# EAGLE board lighthouse-booster (EAGLE 8.3.2)
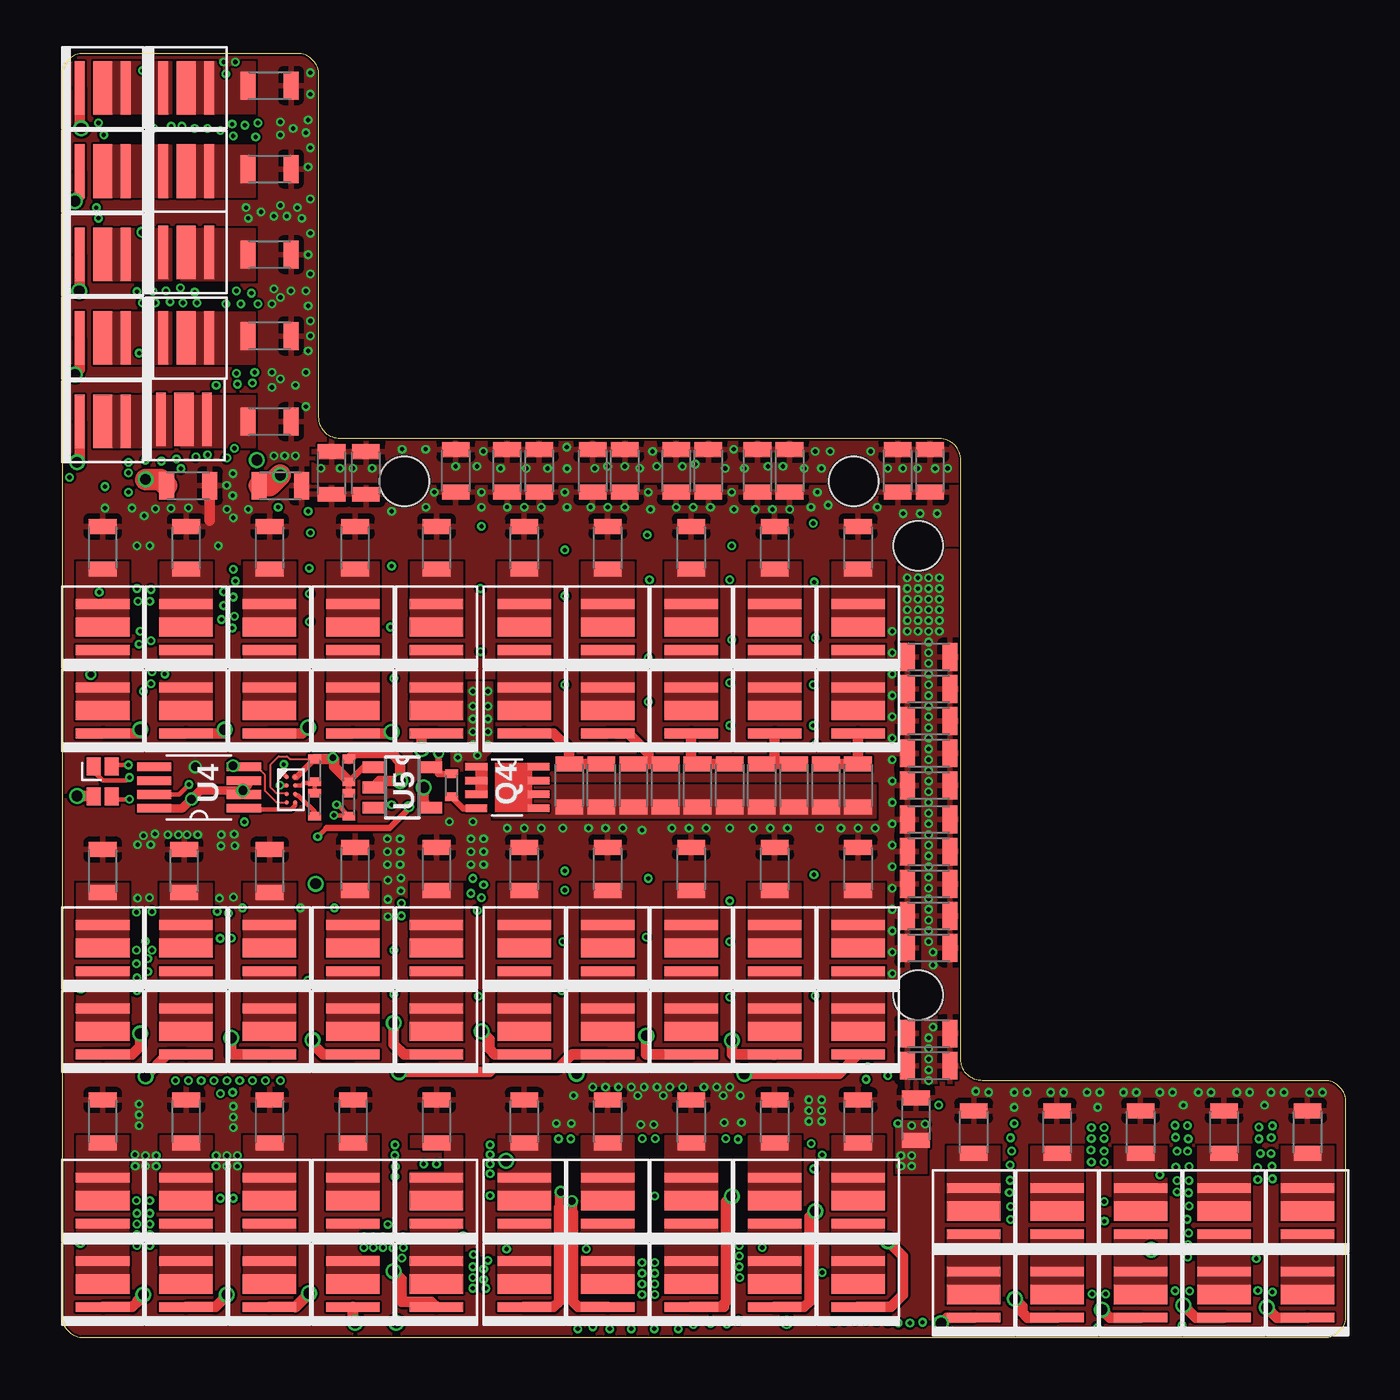
[diagram p2: board, top side]
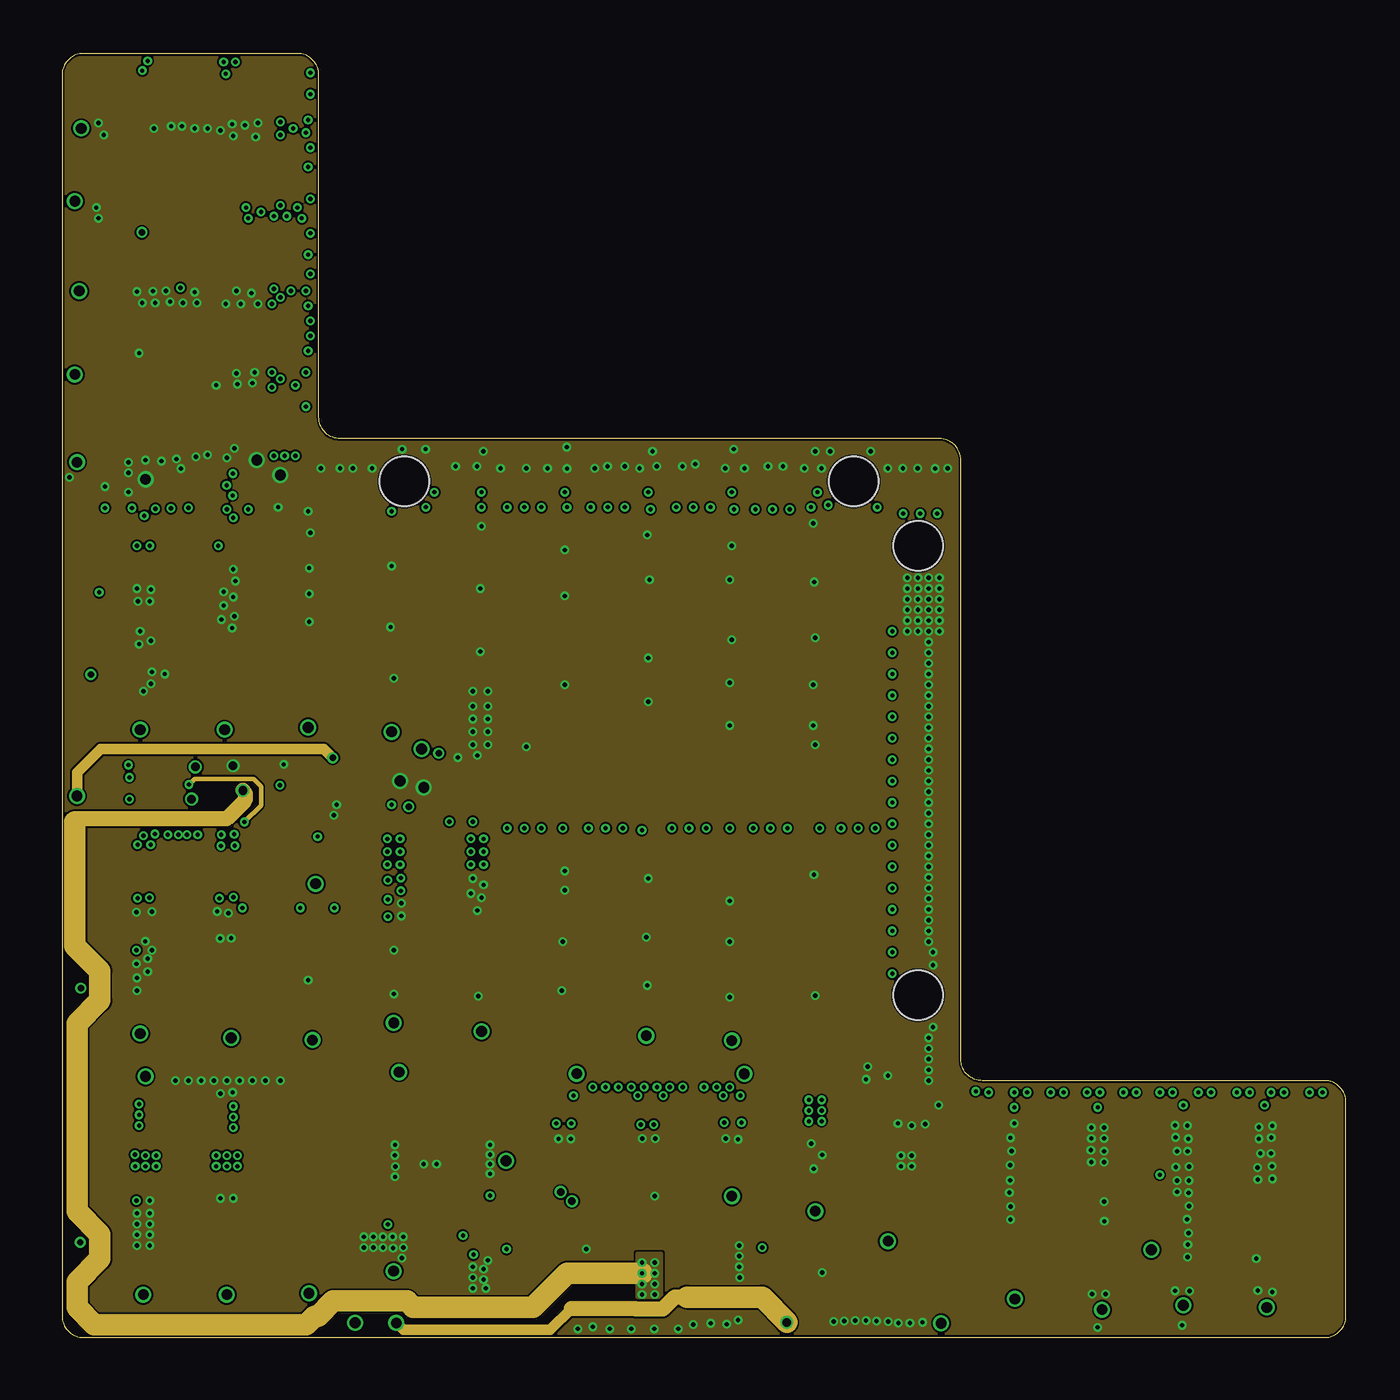
[diagram p3: board, inner layer Route2]
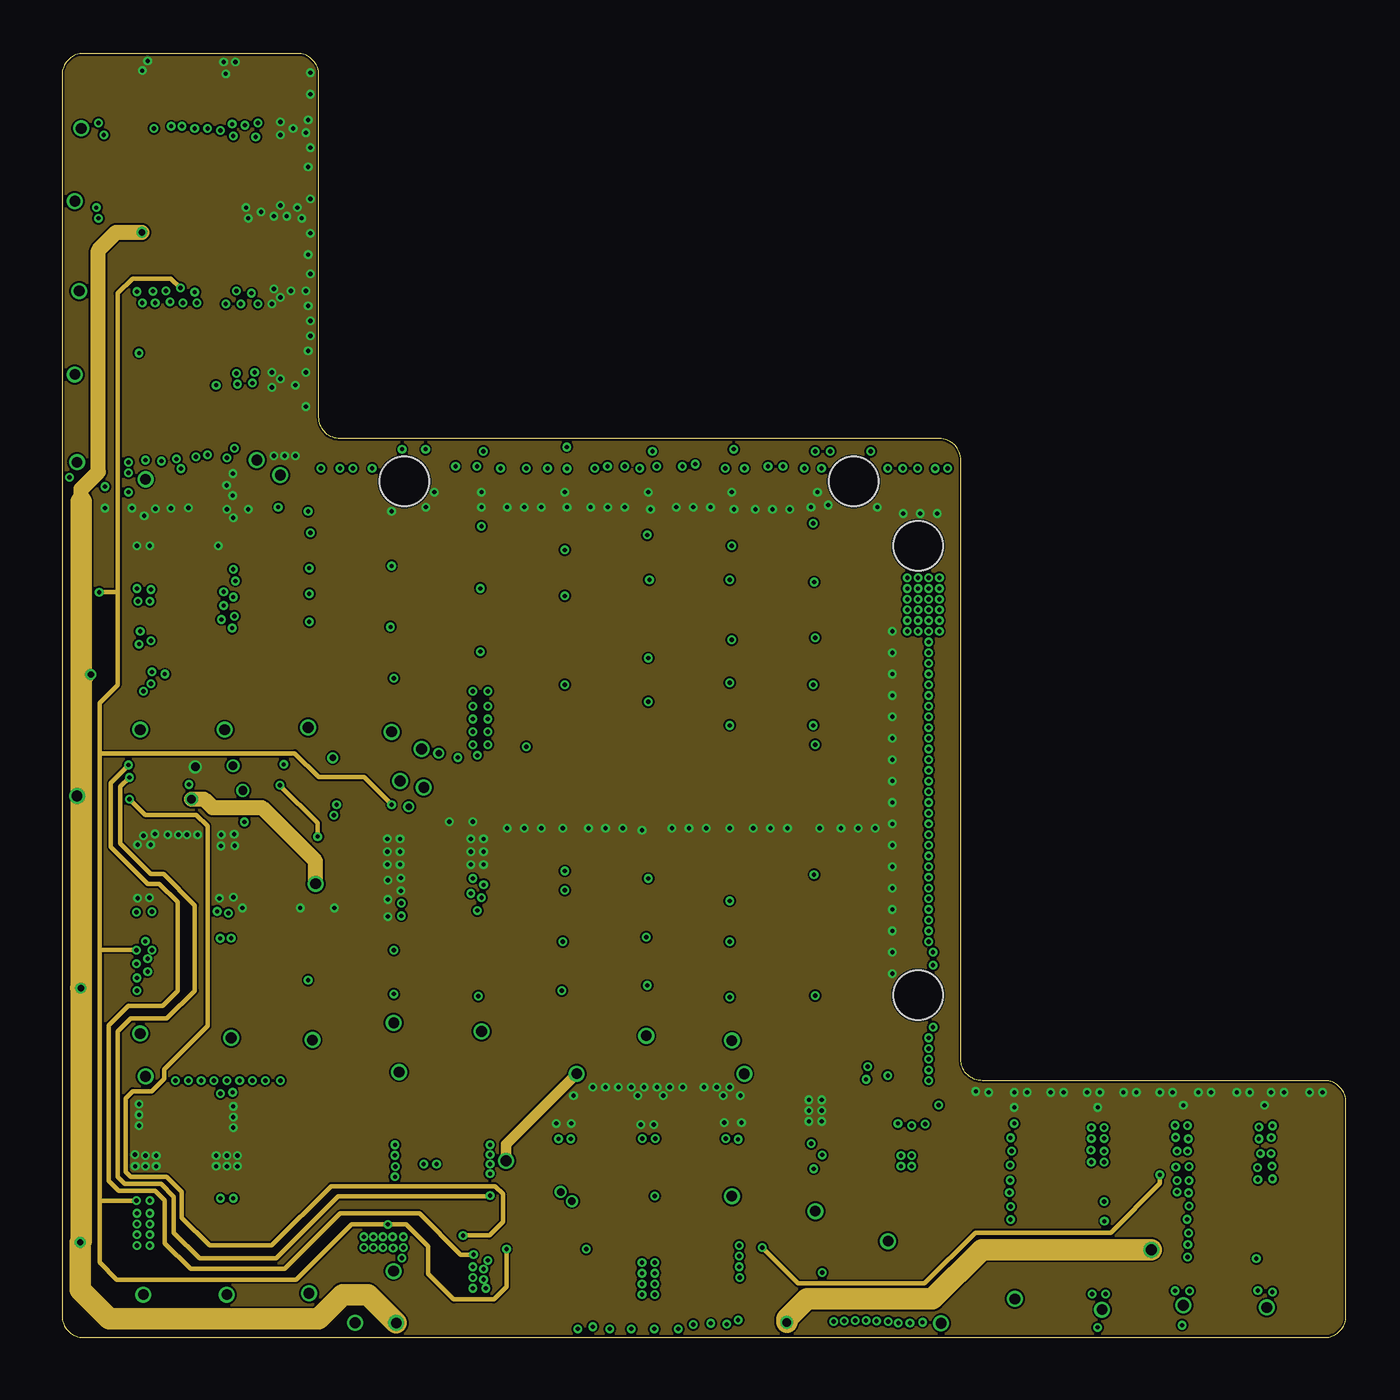
[diagram p4: board, inner layer Route15]
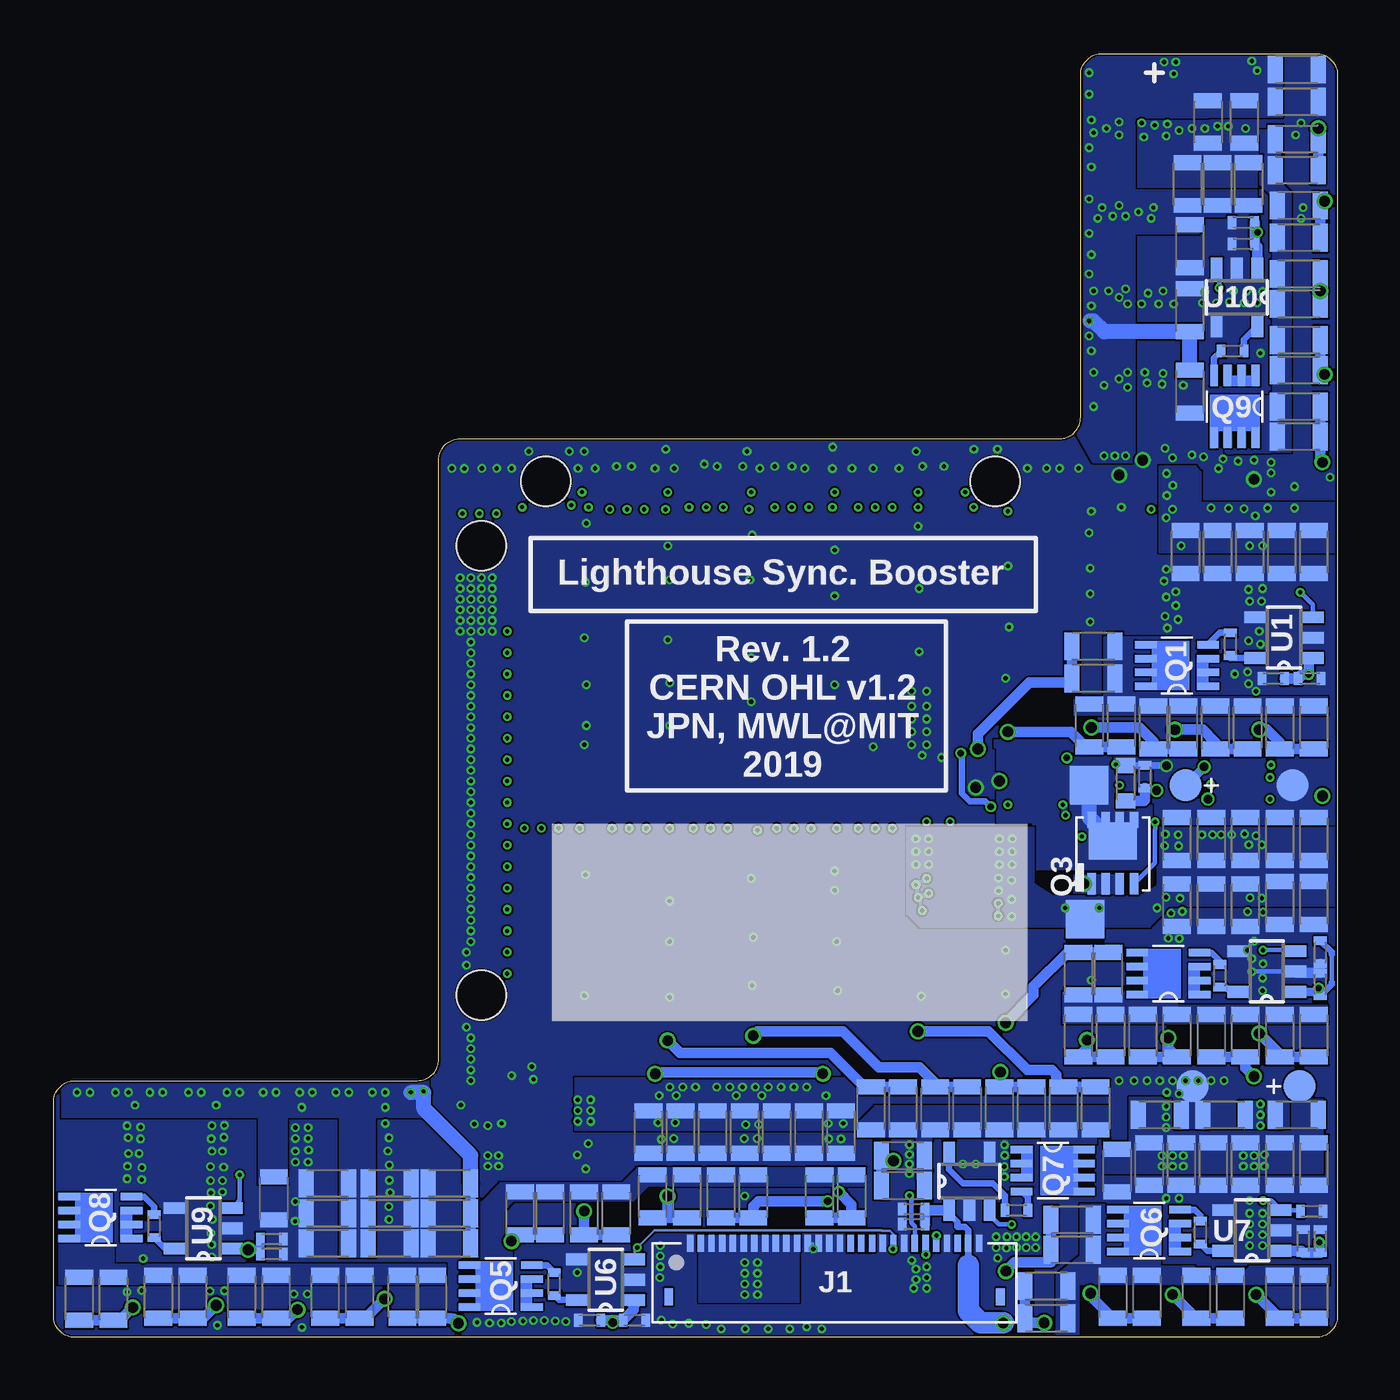
[diagram p5: board, bottom side, seen from below]

Size 60 x 60 mm. Coordinates in mm from the lower left corner, seen from the top.
Outline: 42,13 42,41 arc90 41,42 13,42 arc-90 12,43 12,59 arc90 11,60 1,60 arc90 0,59 0,1 arc90 1,0 59,0 arc90 60,1 60,11 arc90 59,12 43,12 arc-90 42,13
Copper layers (1+2*15+16): Top 0.035mm / dielectric 0.2mm / Route2 0.0175mm / dielectric 1.065mm / Route15 0.0175mm / dielectric 0.2mm / Bottom 0.035mm
Design rules "jlcpcb-4-layer_JLC7628-stackup *": minimum track width 3.5mil, minimum drill 0.2mm, track to track 3.5mil, track to pad 5mil, pad to pad 5mil, via to via 5mil, smd to smd 0mil, copper to edge 0.1mm, drill to drill 5mil, minimum pad ring 4mil, minimum via ring 4mil, stop-mask expansion 3mil, vias tented up to drill 100mil, thermal gap 10mil
Holes 2.3 mm at 40,37 37,40 16,40 40,16
bKeepout: area 7.7,7.8 to 60.1,60

## Footprints (pad centres in the part's own frame; a part is rotated, then mirrored left to right if it is on the bottom)
0805T = smd 0.7 x 1.3: 1 -1,0; 2 1,0
0402T = smd 0.4 x 0.6: 1 -0.533,0; 2 0.533,0
0603T = smd 0.7 x 0.9: 1 -0.82,0; 2 0.82,0
C5MMA-SMD = smd 1.5 x 1.5: A 2.5,0; C -2.5,0
LUXEON-3.7MM = smd 0.9 x 2.5: A1 0,0 | smd 0.45 x 2.5: A2 1.075,0; C -1.075,0
LTST-C19HE1WT = smd 0.65 x 0.85: 1 -0.427,0.725; 2 0.425,0.725; 3 0.425,-0.675; 4 -0.427,-0.675
Y5B/Y5BW-28 = smd 0.3 x 0.8: 1 -6.75,0; 2 -6.25,0; 3 -5.75,0; 4 -5.25,0; 5 -4.75,0; 6 -4.25,0; 7 -3.75,0; 8 -3.25,0; 9 -2.75,0; 10 -2.25,0; 11 -1.75,0; 12 -1.25,0; 13 -0.75,0; 14 -0.25,0; 15 0.25,0; 16 0.75,0; 17 1.25,0; 18 1.75,0; 19 2.25,0; 20 2.75,0; 21 3.25,0; 22 3.75,0; 23 4.25,0; 24 4.75,0; 25 5.25,0; 26 5.75,0; 27 6.25,0; 28 6.75,0 | smd 0.4 x 0.8: P$1 7.75,-2.5; P$2 -7.75,-2.5
PG-TSDSON-8 = smd 1 x 0.35: 1 -1.45,0.975; 2 -1.45,0.325; 3 -1.45,-0.325; 4 -1.45,-0.975; 5 1.45,-0.975; 6 1.45,-0.325; 7 1.45,0.325; 8 1.45,0.975
POWERPACK-1212-8 = smd 1 x 0.4: 1 -0.5,0.99; 2 -0.5,0.33; 3 -0.5,-0.33; 4 -0.5,-0.99 | smd 0.76 x 0.4: 5 2.48,-0.99; 6 2.48,-0.33; 7 2.48,0.33; 8 2.48,0.99 | smd 1.725 x 2.235: PAD 1.5,0
TP18SQ = smd 1.8 x 1.8: TP 0,0
SOT-23-5 = smd 0.55 x 1: 1 -0.95,-1.35; 2 0,-1.35; 3 0.95,-1.35; 4 0.95,1.35; 5 -0.95,1.35
DSBGA8-1.9X0.9MM = smd 0.22 x 0.22: A1 -0.6,-0.2; A2 -0.6,0.2; B1 -0.2,-0.2; B2 -0.2,0.2; C1 0.2,-0.2; C2 0.2,0.2; D1 0.6,-0.2; D2 0.6,0.2
MSOP-8-3X3 = smd 1.6 x 0.4: 1 -2.1,0.975; 2 -2.1,0.325; 3 -2.1,-0.325; 4 -2.1,-0.975; 5 2.1,-0.325; 6 2.1,-0.975; 7 2.1,0.325; 8 2.1,0.975

## Placement (x,y rotation side)
C1  22uF  [0805T]  18.4,40.5 270 top
C2  22uF  [0805T]  2.7,23.3 270 bottom
C3  0.1uF  [0402T]  1.3,30.8 0 bottom
C4  0.1uF  [0402T]  0.8,16.5 90 bottom
C5  4.7uF  [0603T]  9.9,25.9 90 bottom
C6  22uF  [0805T]  5.6,36.7 90 bottom
C7  22uF  [0805T]  5.9,20.2 90 bottom
C8  10nF  [0402T]  3,30.8 180 bottom
C9  10nF  [0402T]  0.8,18 270 bottom
C10  0.1uF  [0402T]  9,26.2 90 bottom
C11  22uF  [0805T]  4.1,36.7 90 bottom
C12  22uF  [0805T]  4.3,20.2 90 bottom
C13  22uF  [0805T]  2.6,36.7 90 bottom
C14  22uF  [0805T]  2.7,20.3 90 bottom
C15  100pF  [0402T]  11.8,24.9 270 top
C16  22uF  [0805T]  1.1,36.7 90 bottom
C17  22uF  [0805T]  1.1,20.3 90 bottom
C18  22uF  [0805T]  12.6,40.4 90 top
C19  22uF  [0805T]  7.5,20.2 270 bottom
C20  22uF  [0805T]  14.2,40.4 90 top
C21  22uF  [0805T]  7.5,23.3 90 bottom
C22  22uF  [0805T]  10.2,39.8 180 top
C23  22uF  [0805T]  5.9,23.3 90 bottom
C24  22uF  [0805T]  5.9,39.8 180 top
C25  22uF  [0805T]  4.3,23.3 90 bottom
C26  22uF  [0805T]  7.1,36.7 270 bottom
C27  22uF  [0805T]  1.1,23.3 90 bottom
C28  2.2mF  [C5MMA-SMD]  4.28,11.74 0 bottom
C29  2.2mF  [C5MMA-SMD]  4.6,25.8 180 bottom
C30  22uF  [0805T]  39.05,40.5 270 top
C31  22uF  [0805T]  40.5,12.7 180 top
C32  22uF  [0805T]  5.3,10.4 0 bottom
C33  0.1uF  [0402T]  13.4,26.5 90 top
C34  0.1uF  [0402T]  32.85,0.8 0 bottom
C35  0.1uF  [0402T]  0.8,4.5 90 bottom
C36  22uF  [0805T]  26.3,40.5 270 top
C37  22uF  [0805T]  26.2,9.6 90 bottom
C38  22uF  [0805T]  5.8,8.1 90 bottom
C39  10nF  [0402T]  13.4,24.9 270 top
C40  10nF  [0402T]  34.95,0.8 180 bottom
C41  10nF  [0402T]  1.6,4.5 90 bottom
C42  22uF  [0805T]  24.8,40.5 270 top
C43  22uF  [0805T]  24.7,9.6 90 bottom
C44  22uF  [0805T]  4.3,8.1 90 bottom
C45  22uF  [0805T]  22.3,40.5 270 top
C46  22uF  [0805T]  23.2,9.6 90 bottom
C47  22uF  [0805T]  2.7,8.1 90 bottom
C48  22uF  [0805T]  20.8,40.5 270 top
C49  22uF  [0805T]  39.9,10.2 90 top
C50  22uF  [0805T]  1.1,8.1 90 bottom
C51  22uF  [0805T]  28.7,40.5 90 top
C52  22uF  [0805T]  27.7,9.6 270 bottom
C53  22uF  [0805T]  7.3,8.1 270 bottom
C54  22uF  [0805T]  30.2,40.5 90 top
C55  22uF  [0805T]  29.2,9.6 270 bottom
C56  22uF  [0805T]  8.8,8.1 270 bottom
C57  22uF  [0805T]  32.5,40.5 90 top
C58  22uF  [0805T]  30.7,9.6 270 bottom
C59  22uF  [0805T]  8.3,10.4 0 bottom
C60  22uF  [0805T]  34,40.5 90 top
C61  22uF  [0805T]  32.2,9.6 270 bottom
C62  22uF  [0805T]  10.3,7.8 270 bottom
C63  22uF  [0805T]  40.55,40.5 90 top
C64  22uF  [0805T]  40.5,14.2 0 top
C65  22uF  [0805T]  1.9,10.4 180 bottom
C66  22uF  [0805T]  40.5,19.7 180 top
C67  22uF  [0805T]  41.5,5.8 0 bottom
C68  22uF  [0805T]  5.6,53.9 270 bottom
C69  0.1uF  [0402T]  19.8,5.3 180 bottom
C70  0.1uF  [0402T]  49.8,4.6 0 bottom
C71  0.1uF  [0402T]  4.4,52.1 180 bottom
C72  22uF  [0805T]  40.5,27.3 180 top
C73  22uF  [0805T]  47.2,5.8 0 bottom
C74  22uF  [0805T]  7,53.9 270 bottom
C75  10nF  [0402T]  19.8,6 180 bottom
C76  10nF  [0402T]  49.8,3.9 0 bottom
C77  10nF  [0402T]  4.4,51.1 180 bottom
C78  22uF  [0805T]  40.5,28.8 180 top
C79  22uF  [0805T]  47.2,7.2 0 bottom
C80  22uF  [0805T]  6.05,56.8 90 bottom
C81  22uF  [0805T]  40.5,30.3 180 top
C82  22uF  [0805T]  44.3,4.4 180 bottom
C83  22uF  [0805T]  4.15,53.9 270 bottom
C84  22uF  [0805T]  40.5,31.8 180 top
C85  22uF  [0805T]  41.5,4.4 0 bottom
C86  22uF  [0805T]  1.9,57.75 0 bottom
C87  22uF  [0805T]  40.5,25.8 0 top
C88  22uF  [0805T]  47.2,4.4 180 bottom
C89  22uF  [0805T]  6.9,51 270 bottom
C90  22uF  [0805T]  40.5,24.2 0 top
C91  22uF  [0805T]  49.7,6.5 270 bottom
C92  22uF  [0805T]  6.9,48 90 bottom
C93  22uF  [0805T]  40.5,22.7 0 top
C94  22uF  [0805T]  44.3,5.8 0 bottom
C95  22uF  [0805T]  6.9,44.2 270 bottom
C96  22uF  [0805T]  40.5,21.2 0 top
C97  22uF  [0805T]  44.3,7.2 0 bottom
C98  22uF  [0805T]  1.9,59.25 0 bottom
C99  22uF  [0805T]  40.5,18.2 0 top
C100  22uF  [0805T]  41.5,7.2 180 bottom
C101  22uF  [0805T]  4.35,56.8 270 bottom
D2  [LUXEON-3.7MM]  17.5,33.2 90 top
D3  [LUXEON-3.7MM]  17.5,29.3 90 top
D5  [LUXEON-3.7MM]  17.5,18.2 90 top
D6  [LUXEON-3.7MM]  17.5,14.3 90 top
D8  [LUXEON-3.7MM]  13.6,33.2 90 top
D9  [LUXEON-3.7MM]  13.6,29.3 90 top
D11  [LUXEON-3.7MM]  13.6,18.2 90 top
D12  [LUXEON-3.7MM]  13.6,14.3 90 top
D14  [LUXEON-3.7MM]  9.7,33.2 90 top
D15  [LUXEON-3.7MM]  9.7,29.3 90 top
D17  [LUXEON-3.7MM]  9.7,18.2 90 top
D18  [LUXEON-3.7MM]  9.7,14.3 90 top
D20  [LUXEON-3.7MM]  5.8,33.2 90 top
D21  [LUXEON-3.7MM]  5.8,29.3 90 top
D23  [LUXEON-3.7MM]  5.8,18.2 90 top
D24  [LUXEON-3.7MM]  5.8,14.3 90 top
D26  [LUXEON-3.7MM]  1.9,33.2 90 top
D27  [LUXEON-3.7MM]  1.9,29.3 90 top
D29  [LUXEON-3.7MM]  1.9,18.2 90 top
D30  [LUXEON-3.7MM]  1.9,14.3 90 top
D31  LTST-C19HE1WT  [LTST-C19HE1WT]  1.9,25.95 0 top
D33  [LUXEON-3.7MM]  37.2,33.2 90 top
D34  [LUXEON-3.7MM]  37.2,29.3 90 top
D36  [LUXEON-3.7MM]  37.2,6.4 90 top
D37  [LUXEON-3.7MM]  37.2,2.5 90 top
D39  [LUXEON-3.7MM]  17.5,6.4 90 top
D40  [LUXEON-3.7MM]  17.5,2.5 90 top
D42  [LUXEON-3.7MM]  33.3,33.2 90 top
D43  [LUXEON-3.7MM]  33.3,29.3 90 top
D45  [LUXEON-3.7MM]  33.3,6.4 90 top
D46  [LUXEON-3.7MM]  33.3,2.5 90 top
D48  [LUXEON-3.7MM]  13.6,6.4 90 top
D49  [LUXEON-3.7MM]  13.6,2.5 90 top
D51  [LUXEON-3.7MM]  29.4,33.2 90 top
D52  [LUXEON-3.7MM]  29.4,29.3 90 top
D54  [LUXEON-3.7MM]  29.4,6.4 90 top
D55  [LUXEON-3.7MM]  29.4,2.5 90 top
D57  [LUXEON-3.7MM]  9.7,6.4 90 top
D58  [LUXEON-3.7MM]  9.7,2.5 90 top
D60  [LUXEON-3.7MM]  25.5,33.2 90 top
D61  [LUXEON-3.7MM]  25.5,29.3 90 top
D63  [LUXEON-3.7MM]  25.5,6.4 90 top
D64  [LUXEON-3.7MM]  25.5,2.5 90 top
D66  [LUXEON-3.7MM]  5.8,6.4 90 top
D67  [LUXEON-3.7MM]  5.8,2.5 90 top
D69  [LUXEON-3.7MM]  21.6,33.2 90 top
D70  [LUXEON-3.7MM]  21.6,29.3 90 top
D72  [LUXEON-3.7MM]  21.6,6.4 90 top
D73  [LUXEON-3.7MM]  21.6,2.5 90 top
D75  [LUXEON-3.7MM]  1.9,6.4 90 top
D76  [LUXEON-3.7MM]  1.9,2.5 90 top
D78  [LUXEON-3.7MM]  37.2,18.2 90 top
D79  [LUXEON-3.7MM]  37.2,14.3 90 top
D81  [LUXEON-3.7MM]  58.2,5.9 90 top
D82  [LUXEON-3.7MM]  58.2,2 90 top
D84  [LUXEON-3.7MM]  5.7,42.9 0 top
D85  [LUXEON-3.7MM]  1.9,42.8 0 top
D87  [LUXEON-3.7MM]  33.3,18.2 90 top
D88  [LUXEON-3.7MM]  33.3,14.3 90 top
D90  [LUXEON-3.7MM]  54.3,5.9 90 top
D91  [LUXEON-3.7MM]  54.3,2 90 top
D93  [LUXEON-3.7MM]  5.8,46.7 0 top
D94  [LUXEON-3.7MM]  1.9,46.7 0 top
D96  [LUXEON-3.7MM]  29.4,18.2 90 top
D97  [LUXEON-3.7MM]  29.4,14.3 90 top
D99  [LUXEON-3.7MM]  50.4,5.9 90 top
D100  [LUXEON-3.7MM]  50.4,2 90 top
D102  [LUXEON-3.7MM]  5.8,50.7 0 top
D103  [LUXEON-3.7MM]  1.9,50.6 0 top
D105  [LUXEON-3.7MM]  25.5,18.2 90 top
D106  [LUXEON-3.7MM]  25.5,14.3 90 top
D108  [LUXEON-3.7MM]  46.5,5.9 90 top
D109  [LUXEON-3.7MM]  46.5,2 90 top
D111  [LUXEON-3.7MM]  5.8,54.5 0 top
D112  [LUXEON-3.7MM]  1.9,54.5 0 top
D114  [LUXEON-3.7MM]  21.6,18.2 90 top
D115  [LUXEON-3.7MM]  21.6,14.3 90 top
D117  [LUXEON-3.7MM]  42.6,5.9 90 top
D118  [LUXEON-3.7MM]  42.6,2 90 top
D120  [LUXEON-3.7MM]  5.8,58.4 0 top
D121  [LUXEON-3.7MM]  1.9,58.4 0 top
J1  AYF532835  [Y5B/Y5BW-28]  23.5,4.4 0 bottom
L1  [0805T]  17.5,36.9 270 top
L2  [0805T]  13.7,36.9 270 top
L3  [0805T]  9.7,36.9 270 top
L4  [0805T]  5.8,36.9 270 top
L5  [0805T]  1.9,36.9 270 top
L6  [0805T]  37.2,36.9 270 top
L7  [0805T]  33.3,36.9 270 top
L8  [0805T]  29.4,36.9 270 top
L9  [0805T]  25.5,36.9 270 top
L10  [0805T]  21.6,36.9 270 top
L11  [0805T]  37.2,21.9 270 top
L12  [0805T]  33.3,21.9 270 top
L13  [0805T]  29.4,21.9 270 top
L14  [0805T]  25.5,21.9 270 top
L15  [0805T]  21.6,21.9 270 top
L16  [0805T]  17.5,21.9 270 top
L17  [0805T]  13.7,21.9 270 top
L18  [0805T]  9.7,21.8 270 top
L19  [0805T]  5.7,21.8 270 top
L20  [0805T]  1.9,21.8 270 top
L21  [0805T]  37.2,10.1 270 top
L22  [0805T]  33.3,10.1 270 top
L23  [0805T]  29.4,10.1 270 top
L24  [0805T]  25.5,10.1 270 top
L25  [0805T]  21.6,10.1 270 top
L26  [0805T]  58.2,9.6 270 top
L27  [0805T]  54.3,9.6 270 top
L28  [0805T]  50.4,9.6 270 top
L29  [0805T]  46.5,9.6 270 top
L30  [0805T]  42.6,9.6 270 top
L31  [0805T]  17.5,10.1 270 top
L32  [0805T]  13.6,10.1 270 top
L33  [0805T]  9.7,10.1 270 top
L34  [0805T]  5.8,10.1 270 top
L35  [0805T]  1.9,10.1 270 top
L36  [0805T]  9.7,42.8 180 top
L37  [0805T]  9.7,46.8 180 top
L38  [0805T]  9.7,50.6 180 top
L39  [0805T]  9.7,54.6 180 top
L40  [0805T]  9.7,58.5 180 top
Q1  BSZ034N04LSATMA1  [PG-TSDSON-8]  7.5,31.4 180 bottom
Q2  BSZ034N04LSATMA1  [PG-TSDSON-8]  7.9,17 180 bottom
Q3  Si7655ADN  [POWERPACK-1212-8]  10.5,21.7 90 bottom
Q4  BSZ034N04LSATMA1  [PG-TSDSON-8]  20.8,25.7 0 top
Q5  BSZ034N04LSATMA1  [PG-TSDSON-8]  39.1,2.4 180 bottom
Q6  BSZ034N04LSATMA1  [PG-TSDSON-8]  8.8,5 180 bottom
Q7  BSZ034N04LSATMA1  [PG-TSDSON-8]  13.3,7.8 0 bottom
Q8  BSZ034N04LSATMA1  [PG-TSDSON-8]  57.8,5.6 180 bottom
Q9  BSZ034N04LSATMA1  [PG-TSDSON-8]  4.8,43.5 270 bottom
R1  0.36  [0805T]  11.4,30.8 180 bottom
R2  0.36  [0805T]  12.1,17 90 bottom
R3  0.36  [0805T]  11.4,32.3 180 bottom
R4  0.36  [0805T]  10.7,17 90 bottom
R5  10k  [0402T]  1.2,5.9 180 bottom
R6  0.36  [0805T]  11.6,28.6 270 bottom
R7  0.36  [0805T]  12.1,14.1 270 bottom
R8  0.36  [0805T]  10.1,28.6 270 bottom
R9  0.36  [0805T]  10.6,14.1 270 bottom
R10  10k  [0402T]  11.8,26.5 270 top
R11  0.36  [0805T]  7.2,28.5 270 bottom
R12  0.36  [0805T]  7.5,14.1 270 bottom
R13  0.36  [0805T]  8.6,28.5 270 bottom
R14  0.36  [0805T]  9.1,14.1 270 bottom
R15  0.36  [0805T]  4.2,28.5 270 bottom
R16  0.36  [0805T]  4.3,14.1 270 bottom
R17  0.36  [0805T]  5.7,28.5 270 bottom
R18  0.36  [0805T]  5.9,14.1 270 bottom
R19  10  [0402T]  5,32.4 90 bottom
R20  10  [0402T]  5.5,16.9 90 bottom
R21  0.36  [0805T]  2.7,28.5 270 bottom
R22  0.36  [0805T]  2.7,14.1 270 bottom
R23  0.36  [0805T]  1.1,28.5 270 bottom
R24  0.36  [0805T]  1.1,14.1 270 bottom
R25  0.36  [0805T]  35.7,25.8 90 top
R26  0.36  [0805T]  36.8,5.8 270 bottom
R27  0.36  [0805T]  12.4,4.1 180 bottom
R28  0.36  [0805T]  37.2,25.8 90 top
R29  0.36  [0805T]  38.2,5.8 270 bottom
R30  0.36  [0805T]  12.4,5.5 180 bottom
R31  0.36  [0805T]  34.2,25.8 90 top
R32  0.36  [0805T]  33.7,5.8 270 bottom
R33  0.36  [0805T]  13.6,0.9 180 bottom
R34  0.36  [0805T]  32.7,25.8 90 top
R35  0.36  [0805T]  35.2,5.8 270 bottom
R36  0.36  [0805T]  13.6,2.4 180 bottom
R37  0.36  [0805T]  29.7,25.8 90 top
R38  0.36  [0805T]  30.4,6.6 270 bottom
R39  0.36  [0805T]  8.9,1.9 270 bottom
R40  0.36  [0805T]  31.2,25.8 90 top
R41  0.36  [0805T]  32,6.6 270 bottom
R42  0.36  [0805T]  10.5,1.9 270 bottom
R43  0.36  [0805T]  26.7,25.8 90 top
R44  0.36  [0805T]  27.3,6.6 270 bottom
R45  0.36  [0805T]  5,1.9 270 bottom
R46  0.36  [0805T]  28.2,25.8 90 top
R47  0.36  [0805T]  28.8,6.6 270 bottom
R48  0.36  [0805T]  6.6,1.9 270 bottom
R49  10  [0402T]  6.4,4.9 90 bottom
R50  10  [0402T]  18.2,25.8 270 top
R51  10  [0402T]  36.6,2.5 90 bottom
R52  0.36  [0805T]  25.2,25.8 90 top
R53  0.36  [0805T]  24.2,6.6 270 bottom
R54  0.36  [0805T]  2.7,1.9 270 bottom
R55  0.36  [0805T]  23.7,25.8 90 top
R56  0.36  [0805T]  22.7,6.6 270 bottom
R57  0.36  [0805T]  1.1,1.9 270 bottom
R58  0.36  [0805T]  20.3,7.1 180 bottom
R59  0.36  [0805T]  57.2,1.8 270 bottom
R60  0.36  [0805T]  1.8,43.5 0 bottom
R61  0.36  [0805T]  20.3,8.5 180 bottom
R62  0.36  [0805T]  58.8,1.8 270 bottom
R63  0.36  [0805T]  1.8,42.1 0 bottom
R64  0.36  [0805T]  20.3,10.7 90 bottom
R65  0.36  [0805T]  53.5,1.9 270 bottom
R66  0.36  [0805T]  1.8,46.6 0 bottom
R67  0.36  [0805T]  21.8,10.7 90 bottom
R68  0.36  [0805T]  55.1,1.9 270 bottom
R69  0.36  [0805T]  1.8,45.2 0 bottom
R70  0.36  [0805T]  17.3,10.7 90 bottom
R71  0.36  [0805T]  49.6,1.9 270 bottom
R72  0.36  [0805T]  1.8,49.7 0 bottom
R73  0.36  [0805T]  18.8,10.7 90 bottom
R74  0.36  [0805T]  51.2,1.9 270 bottom
R75  0.36  [0805T]  1.8,48.3 0 bottom
R76  0.36  [0805T]  14.3,10.7 90 bottom
R77  0.36  [0805T]  47.3,1.9 270 bottom
R78  0.36  [0805T]  1.8,51.4 0 bottom
R79  0.36  [0805T]  15.8,10.7 90 bottom
R80  0.36  [0805T]  45.7,1.9 270 bottom
R81  0.36  [0805T]  1.8,52.9 0 bottom
R82  10  [0402T]  15,5.94 0 bottom
R83  10  [0402T]  55.3,5.2 90 bottom
R84  10  [0402T]  4.9,46.1 180 bottom
R85  0.36  [0805T]  12.8,10.7 90 bottom
R86  0.36  [0805T]  43.7,1.9 270 bottom
R87  0.36  [0805T]  1.9,54.55 0 bottom
R88  0.36  [0805T]  11.3,10.7 90 bottom
R89  0.36  [0805T]  42.3,1.9 270 bottom
R90  0.36  [0805T]  1.9,56 0 bottom
TP1  [TP18SQ]  11.6,25.8 0 bottom
TP2  [TP18SQ]  11.8,19.55 0 bottom
U1  UCC27517DBVR  [SOT-23-5]  2.5,32.7 90 bottom
U2  UCC27517DBVR  [SOT-23-5]  3.3,17.1 90 bottom
U3  SN74LVC1G123YZPR  [DSBGA8-1.9X0.9MM]  10.7,25.6 270 top
U4  LTC1693-5  [MSOP-8-3X3]  6.4,25.7 180 top
U5  UCC27517DBVR  [SOT-23-5]  15.9,25.7 270 top
U6  UCC27517DBVR  [SOT-23-5]  34.2,2.7 90 bottom
U7  UCC27517DBVR  [SOT-23-5]  4,5 90 bottom
U8  UCC27517DBVR  [SOT-23-5]  17.2,7.3 0 bottom
U9  UCC27517DBVR  [SOT-23-5]  53,5.1 90 bottom
U10  UCC27517DBVR  [SOT-23-5]  4.7,48.6 180 bottom

## Tracks (layer width: path | path; a pad name or v marks a point on that pad's centre or on a via)
+5V0  (via drill 0.3, 0.4, 0.5)
  Top 0.1: U3.C1 10.48,25.42 10.02,25.42 9.75,25.69 9.75,26.78 10.13,27.16 10.52,27.16 10.64,27.03 R10.1
  Top 0.3: U3.A2 10.97,26.2 R10.1 | C39.1 C33.1 14.08,26.65 U5.1
  Top 0.5: v0.7,25.3 1.45,25.3 D31.4 | C33.1 13.4,26 12.72,26.68 12.72,27.01 v12.65,27.08 12.6,27.03 R10.1
  Route2 0.5: 23.8,1.38 23.8,1.35 22.8,0.35 15.95,0.35 v15.62,0.68 | v0.7,25.3 0.7,26.4 1.8,27.5 12.23,27.5 v12.65,27.08
  Route2 0.7: 26.79,1.35 | 26.79,1.35 23.8,1.35 | 29.2,1.89 28.63,1.89 28.06,1.32 26.82,1.32 26.79,1.35
  Route2 1: v33.87,0.7 32.73,1.89 29.2,1.89
  Route15 0.2: v0.7,25.3 0.75,25.35 0.89,25.35
  Route15 0.4: 49.1,4.1 49,4.1
  Route15 0.5: 0.89,30.8 1.17,30.8 v1.34,30.98
  Route15 0.7: 0.89,39.07 0.89,39.65 1.69,40.45 1.69,50.81 2.53,51.65 v3.73,51.65
  Route15 1: 0.89,39.07 0.89,30.8 0.89,25.35 0.89,16.32 | 49,4.1 42.98,4.1 40.68,1.8 34.8,1.8 33.87,0.87 v33.87,0.7 | v50.9,4.1 49.1,4.1 | v15.62,0.68 14.3,2 13.1,2 11.98,0.88 2.2,0.88 0.85,2.23 v0.85,4.45 0.89,4.48 0.89,16.32 | v0.88,16.33 0.89,16.32
  Bottom 0.127: 33.67,0.7 v33.87,0.7
  Bottom 0.2: 0.27,17.89 0.27,16.6
  Bottom 0.3: 17.25,3.62 J1.27 17.25,5 17.42,5.17 17.75,5.17 17.75,5.4 18.15,5.8 U8.1 | 0.27,17.89 0.27,18.01 C9.1 | 0.27,16.6 0.27,16.49 C4.1 | v33.87,0.7 33.77,0.8 C34.1
  Bottom 0.4: U9.1 50.95,4.15 v50.9,4.1 50.34,4.1 50.33,4.1 | 50.33,4.1 C70.1 | 50.33,4.1 C76.1 | U2.1 0.98,16.15 C4.1 0.88,16.05 v0.88,16.33
  Bottom 0.5: U7.1 1.68,4.05 C41.1 C35.1 0.85,4.02 v0.85,4.45 | 19.2,5.95 U8.1 | 19.2,5.95 19.22,5.95 C75.1 | C69.1 19.27,5.88 19.2,5.95 | C8.1 C3.1 1.66,30.98 v1.34,30.98 1.34,31.55 U1.1 | C40.1 C34.1 32.89,1.29 32.89,1.48 32.85,1.52 U6.1 | 17.25,3.37 17.25,3.62 | v3.73,51.65 3.87,51.78 C71.1 C77.1 3.75,50.98 U10.1
  Bottom 1: 17.25,3.37 17.25,1.25 16.68,0.68 v15.62,0.68
+12V  (via drill 0.2, 0.4)
  Top 0.5: 6.9,38.17 C24.1
  Bottom 0.4: C67.2 C85.2 | v6.23,26.66 C29.A
  Bottom 0.5: C85.2 C100.1
  Bottom 0.7: 11.55,47.5 11.4,47.5 10.9,47 C92.1 C95.1 | C100.1 40.5,8.5 42.7,10.7 42.7,11.45 v43.3,11.45
  other vias: 42.7,11.5 45.1,11.45 46.8,11.45 47.9,11.45 49.6,11.45 51.9,11.45 53.7,11.45 54.9,11.45 56.5,11.45 58.9,11.45 44.5,11.45 46.2,11.45 48.5,11.45 50.2,11.45 51.3,11.45 53.1,11.45 55.5,11.45 57.1,11.45 58.3,11.45 10.2,56.2 10.8,56.5 9.9,52.4 11,52.8 10.7,48.9 9.8,48.3 9.8,45.1 3.84,38.4 2,38.76 4.37,38.72 5.09,38.75 5.9,38.77 7.7,38.7 8,38.3 3.5,37 3.27,38.76 4.1,37 7.3,37 7.69,39.82 7.97,39.34 7.99,40.37 8.07,22.98 7.44,23.5 8.04,23.52 7.43,22.97 3.8,23.45 4.14,23.03 7.35,20.52 3.53,20.53 27.05,9.94 27.65,9.94 30.95,10.04 31.75,10.04 34.9,10.1 35.5,10.1 23.1,10 23.8,10 24.8,11.7 25.4,11.7 26,11.7 28.4,11.7 29,11.7 26.6,11.7 27.2,11.7 26.9,11.3 27.8,11.7 28.1,11.3 30,11.7 34.9,11.1 35.5,11.1 34.9,10.6 30.6,11.7 31.2,11.7 30.9,11.3 31.7,11.3 35.5,10.6 23.9,11.3 3.6,10.9 3.6,10.4 3.6,9.9 8,10.8 8,10.3 8,9.8 3.41,8.55 4.4,8.5 3.42,8 3.9,8 7.2,8.5 7.7,8.5 8.2,8.5 8.2,8 7.7,8 7.2,8 3.9,8.5 4.4,8 4.09,20.55 8.01,20.57 3.53,23.02 15.2,22.1 15.8,22.1 15.8,22.7 15.2,22.7 15.2,23.3 15.8,23.3 19.1,22.1 19.7,22.1 19.7,22.7 19.1,22.7 19.1,23.3 19.7,23.3 9.8,44.4 10.2,48.6 10.5,52.4 10.2,52.9 9.9,49 10.2,44.8 11.2,52.3 10.2,56.8 11.4,56.3 11.4,48.9 9.9,41.2 10.4,41.2 10.9,41.2 20.8,23.8 21.6,23.8 22.4,23.8 20.8,38.8 21.6,38.8 22.4,38.8 15.4,38.6 17,38.8 17.4,39.5 24.6,23.8 25.4,23.8 26.2,23.8 28.5,23.8 29.3,23.8 30.1,23.8 32.3,23.8 33.1,23.8 33.9,23.8 36.4,23.8 37.2,23.8 38,23.8 39.3,38.5 40.1,38.5 40.9,38.5 32.4,38.7 33.2,38.7 34,38.7 28.7,38.8 29.5,38.8 30.3,38.8 24.7,38.8 25.5,38.8 26.3,38.8 38.8,25 38.8,26 38.8,27 38.8,28 38.8,29 38.8,30 38.8,31 38.8,32 38.8,33 38.8,24 38.8,23 38.8,22 38.8,21 38.8,20 38.8,19 38.8,18 38.8,17 11.6,47.5 11.5,46.1 11.4,45.1 11.4,43.5 11.5,50.6 11.5,54.7 11.6,58.1 4.34,23.53 5.84,23.5 4.94,23.5 6.34,23.5 5.44,23.5 8.43,20.07 11.13,20.07 12.73,20.07 15.23,20.47 15.83,20.87 15.23,21.37 15.83,21.47 15.23,19.67 9.3,52.6 8.7,52.3 8.6,52.8 10.9,44.5 44.5,10.75 48.4,10.75 52.4,10.85 56.2,10.85 11.6,49.7 11.5,48.2 11.6,46.8 11.6,51.6 11.6,53.2 11.6,55.6 11.6,59.1 8.7,38.7 27.1,23.7 23.4,23.8 31.2,23.8 35.4,23.8 19.2,24.1 18.1,24.1 23.6,38.8 19.6,38.8 27.5,38.7 31.4,38.7 35,38.8 38.1,38.8 35.8,38.9 35.3,39.5 31.3,39.5 27.4,39.5 23.5,39.5 19.6,39.5 11.5,56.9 7.55,59.6 4,59.65 3.75,59.2 7.65,59.05 8.1,59.6
  pour Bottom (no thermals): 9.5,40.9 11.4,40.9 12.2,42.3 12.2,60 2.6,60.05 2.6,57.05 9.5,57 9.5,53.6 3.8,53.6 3.8,52.4 6.5,52.4 6.5,51.6 9.5,51.6
  pour Bottom (no thermals): 0.7,11.1 2.1,11.1 2.1,9.6 7.7,9.6 7.7,11.2 9.7,11.2 9.7,9.1 10.9,9.1 10.9,7.7 0.7,7.7
  pour Bottom (no thermals): 22.6,12.1 22.6,9.7 35.6,9.7 35.6,12.1
  pour Top (isolate 0.1, rank 2): -18,77 82,77 82,-23 -18,-23
  pour Bottom (no thermals): 42.5,10.3 45,10.3 45,3.8 46.6,3.8 46.6,10.3 49.1,10.3 49.1,7.2 50.4,7.2 50.4,10.3 59.6,10.3 59.6,12.3 42.5,12.3
  pour Bottom (no thermals): -0.2,36.7 8.3,36.7 8.3,40.7 6.65,40.7 6.4,40.45 6.4,39 -0.2,39
  pour Route15 (rank 2, no thermals): -13,72 77,72 77,-18 -13,-18
  pour Bottom (no thermals): 3.5,9.8 3.5,11 4.6,11 4.6,9.8
  pour Bottom (no thermals): -0.3,20.2 -0.3,23.8 8.4,23.8 8.4,21.1 9.2,20.6 13.3,20.6 14.2,21.2 14.2,23.8 20.1,23.8 20.1,19.8 19.5,19.2 8.8,19.2 7.8,20.2
BLUE_C  (via drill 0.2)
  Top 0.2: v3.15,25.15 2.45,25.15 D31.3
  Route15 0.2: v18.74,4.77 19.97,4.77 20.6,5.4 20.6,6.7 20.23,7.07 12.57,7.07 9.8,4.3 6.9,4.3 5.6,5.6 5.6,6.8 4.9,7.5 3.2,7.5 2.97,7.73 2.97,11.17 3.3,11.5 4.19,11.5 4.77,12.09 4.77,12.52 6.8,14.55 6.8,23.9 6.27,24.43 3.88,24.43 v3.15,25.15
  Bottom 0.2: J1.24 18.74,4.41 v18.74,4.77
GND  (via drill 0.2, 0.4, 0.5)
  Top 0.1: U3.D1 10.04,25 9.48,25.56 9.48,26.3 9.1,26.68 U4.4
  Top 0.2: U3.A1 10.36,26.34 v10.36,26.78 | v12.7,24.4 13.37,24.4 C39.2 12.87,24.9 v12.83,24.9
  Top 0.3: U4.4 8.03,26.68 v7.99,26.72
  Top 0.5: U5.2 14.85,26 15.43,26 v15.8,26 15.8,26.9 15.4,27.3 13.67,27.3 C33.2 | U5.4 arc-90 16.9,25.1 v16.9,25.7
  Top 1: v10.2,40.3 9.7,39.8 C22.2 | C24.2 4.6,40.1 v3.9,40.1
  Bottom 0.127: J1.12 24.5,4.4 v24.5,4.13
  Bottom 0.2: U2.2 v4,17.1
  Bottom 0.3: v7.99,26.72 8.98,26.72 C10.2 9.89,26.73 C5.2
  Bottom 0.4: 8.94,26.73 C10.2
  Bottom 0.5: C9.2 C4.2 1.88,17.03 U2.2
  other vias: 2,39.76 3.1,40.4 41,34.5 40.5,34.5 40.5,34 41,34 41,33.5 40.5,33.5 41,33 40.5,33 40.5,32.5 40.5,32 40.5,31.5 40.5,31 40.5,30.5 40.5,30 40.5,29.5 40.5,29 40.5,28.5 40.5,28 40.5,27.5 40.5,27 40.5,26.5 40.5,26 40.5,25.5 40.5,25 40.5,24.5 40.5,24 40.5,23.5 40.5,23 40.5,22.5 40.5,22 40.5,21.5 40.5,21 40.5,20.5 40.5,20 40.5,19.5 40.5,19 40.5,18.5 40.7,18 40.7,14.5 40.5,14 40.5,13.5 40.5,13 40.5,12.5 40.5,12 39.2,8.5 39.7,8.5 39.2,8 39.7,8 41,35.5 40.5,35.5 41,35 40.5,35 3.5,5.8 4.1,4.8 3.5,4.8 3.5,4.3 4.1,4.3 4.1,5.3 3.5,5.3 4.1,5.8 4.1,6.4 8,6.5 7.4,6.5 15.56,9 15.55,8.51 15.57,7.98 15.56,7.51 19.2,28.3 19.4,27.2 19.2,28.9 19.9,27.7 19.9,28.9 19.2,27.7 19.9,28.3 9.1,41 18.39,40.71 20.49,40.61 19.39,40.71 19.69,41.41 21.69,40.61 22.69,40.61 23.59,41.61 24.89,40.61 25.49,40.71 26.29,40.71 26.99,40.61 27.59,41.41 27.79,40.71 28.99,40.71 29.59,40.81 30.99,40.61 31.39,41.51 31.89,40.61 32.99,40.71 33.69,40.71 34.69,40.61 35.49,40.61 35.19,41.41 37.79,41.41 35.89,41.41 38.59,40.61 39.29,40.61 39.99,40.61 41.39,40.61 23.6,40.6 12.09,40.61 12.99,40.61 13.59,40.61 14.49,40.61 40.8,40.6 3.89,18.51 3.48,19.87 7.25,19.91 7.39,18.65 7.9,18.66 7.78,19.82 4,17.7 3.47,17.46 3.5,16.8 3.5,16.2 7.97,11.45 7.1,12 5.9,12 7.7,12 6.5,12 8.3,12 8.9,12 9.5,12 15.95,4.7 15,4.7 15.45,4.7 20,7.65 23.2,9.28 23.77,9.28 31.02,9.29 31.59,9.26 35.12,7.88 35.01,9.06 35.52,8.53 37.57,12.06 38.59,12.24 37.65,12.65 39.06,10 40.34,9.97 40.97,10.86 36.06,0.75 37.06,0.79 38.06,0.77 38.6,0.74 39.62,0.67 40.21,0.71 39.08,0.67 37.57,0.79 36.55,0.77 15.95,4.2 15.47,4.18 15.88,3.71 31.64,4.3 31.64,3.8 31.64,3.3 31.67,2.8 31.59,0.81 31.06,0.62 35.52,3.03 30.31,0.66 44.3,8.05 44.31,7.34 44.32,9.33 44.27,6.77 44.33,6.11 44.32,5.51 48.1,8.2 48.08,8.75 48.7,6.35 48.71,5.43 52.05,7.96 52.67,7.99 52.66,7.33 52.1,7.33 52.1,6.8 52.64,6.76 52.64,4.88 52.6,3.76 55.81,3.69 55.87,7.94 56.56,7.41 56.55,8 56.51,9.34 52.63,9.28 52.04,9.35 52.01,9.91 52.59,9.9 55.93,9.28 55.93,9.83 56.56,9.89 55.88,7.38 52.67,6.14 52.57,5.52 52.61,4.34 48.69,8.2 48.14,2.03 48.76,2.03 52.01,2.18 52.69,2.17 55.88,2.19 56.56,2.12 27.12,9.29 27.72,9.29 5.3,12 19.2,29.5 19.2,30.2 19.9,29.5 19.9,30.2 10.2,12 7.4,11.4 40,34.5 39.5,34.5 39.5,34 40,34 40,33.5 39.5,33.5 40,33 39.5,33 40,35.5 39.5,35.5 40,35 39.5,35 40.7,17.4 19.7,3.2 19.2,2.8 20,8.1 20,8.55 20,9 14.55,4.7 15,4.2 14.1,4.7 14.1,4.2 14.55,4.2 17.5,8.1 16.9,8.1 19.2,3.3 19.9,3.6 3.5,35 4.15,34.95 3.65,33 4.15,32.55 7.55,34.85 7.55,34.2 7.45,33.55 7.95,33.15 8.05,33.7 8,34.6 8,35.9 8.1,35.35 3.8,30.2 4.15,30.55 4.2,31.1 3.6,32.4 3.55,34.4 4.1,34.4 4.35,48.35 3.5,48.87 5.65,48.35 6.3,48.35 8.15,48.9 8.15,45.05 8.2,44.55 9,45.1 8.05,41.55 3.9,41 5.35,41.05 6.8,41.25 7.7,41.1 3.75,48.35 5.05,48.4 23.5,30.5 23.5,34.65 19.55,32.05 19.55,35 15.35,33.2 15.4,36.05 11.55,35.95 11.55,33.45 27.45,35.4 27.4,31.75 31.2,30.6 31.2,35.4 35.15,35.3 35.1,30.5 35.1,38.05 31.2,15.9 31.2,20.4 27.4,21.45 27.35,16.45 23.35,16.2 23.5,20.9 19.4,19.95 19.45,15.95 15.5,16.05 15.85,19.7 11.5,16.7 52.34,0.57 48.39,0.47 35.19,15.97 35.14,21.62 15.89,41.51 16.99,41.51 4.8,31 3.1,39.5 19.7,2.7 19.2,2.3 19.8,2.3 15.85,20.3 19.6,20.55 19.1,20.75 19.7,21.15 19.2,21.45 27.68,0.4 24.1,0.4 25.6,0.4 26.6,0.4 28.8,0.4 29.5,0.6 44.5,10 44.38,8.71 48.7,8.7 48.1,9.3 48.7,9.3 48.1,9.8 48.7,9.8 39.7,9.9 5.1,56.6 5.6,56.6 6.2,56.5 6.8,56.5 7.4,56.4 7.95,56.7 8.55,56.65 8,56.15 9.05,56.1 9.15,56.75 4.3,56.5 8.85,48.8 7.65,48.3 4.25,48.89 4.85,48.9 8.35,48.3 9.15,48.3 52.1,8.7 52.6,8.7 4.2,18.1 18.5,27.1 4.2,19.9 6.2,48.85 1.7,56.75 1.6,52.8 3.6,46 7.2,44.5 8.9,44.6 3.1,40.9 11.6,37.6 19.6,37.9 23.5,36.8 31.3,37 31.3,32.6 35.2,32.7 35.1,28.6 31.2,28.6 27.4,29.7 15.5,30.8 15.5,18.1 11.5,38.6 10.1,38.8 31.2,18.5 27.3,18.7 23.4,18.5 23.5,21.8 24.8,0.5 27.7,6.6 56,8.6 56.5,8.6 21.7,27.6 35.2,27.7 27.35,37.5 11.55,34.75 1.7,52.3 1.95,56.2 0.35,40.2 4.65,40.95 5.55,40.6 6.25,41.15
  pour Route2 (rank 2, no thermals): -23,82 87,82 87,-28 -23,-28
  pour Top: 11.7,40 42.7,40 42.7,42.8 11.7,42.8
  pour Top: 42.6,11.9 40.2,11.9 40.2,32.6 39.1,32.6 39.1,36.8 42.6,36.8
  pour Top (no thermals): 40.4,10.1 39,10.1 39,7.7 40.4,7.7
  pour Top (no thermals): 19.8,25.2 19.8,27.1 20.1,27.4 20.1,30.6 19,30.6 19,27.5 18.2,27.5 18.2,26.5 18.9,26.5 18.9,25.2
  pour Bottom (rank 3, no thermals): -8,67 72,67 72,-13 -8,-13
GREEN_C  (via drill 0.2)
  Top 0.2: v3.1,26.75 2.4,26.75 D31.2
  Route15 0.2: v19.23,3.87 18.63,3.87 16.7,5.8 13,5.8 10.4,3.2 6,3.2 4.8,4.4 4.8,6.4 4.35,6.85 2.65,6.85 2.18,7.32 2.18,14.58 3.1,15.5 4.7,15.5 5.4,16.2 5.4,20.35 4.55,21.2 4,21.2 2.27,22.93 2.27,25.9 3.12,26.75 v3.1,26.75
  Bottom 0.2: 19.25,4.65 19.27,4.67 | 19.25,4.65 J1.23 | 19.25,4.65 v19.23,3.87
N$1  (via drill 0.5)
  Top 0.5: v3.8,2 3.53,1.73 3.53,1.67 3.28,1.42 D76.C
  Bottom 0.5: R57.2 R54.2 v3.8,2
N$2
  pour Top (no thermals): 0.7,5.5 3.1,5.5 3.1,2.1 0.7,2.1
N$3
  pour Top (no thermals): 0.7,9.4 3.1,9.4 3.1,6 0.7,6
N$4
  pour Bottom (no thermals): 0.4,3.3 0.4,2.5 12.1,2.5 12.1,0.1 13.1,0.1 13.1,2.9 12,3.8 12,6.2 8.3,6.2 8.3,3.3 6.7,3.3 6.5,3.1 4.3,3.1 4.1,3.3
N$5
  Bottom 0.3: R49.1 6.08,4.05 U7.5
N$6  (via drill 0.5)
  Top 0.5: 10.91,1.42 D58.C
  Top 0.508: v11.54,2.06 10.91,1.43 10.91,1.42
  Bottom 0.4: v11.54,2.06 11.54,1.94 11.37,1.77
  Bottom 0.5: 11.37,1.77 R42.2 R39.2
N$7
  pour Top (no thermals): 8.5,5.5 10.9,5.5 10.9,2.1 8.5,2.1
N$8  (via drill 0.5)
  Top 0.5: v7.7,2 7.7,1.95 7.18,1.42 D67.C
  Bottom 0.5: R45.2 R48.2 v7.7,2
N$9
  pour Top (no thermals): 4.6,5.5 7,5.5 7,2.1 4.6,2.1
N$10
  pour Top (no thermals): 4.6,9.4 7,9.4 7,6 4.6,6
N$11  (via drill 0.5)
  Top 0.5: D30.C 3.28,13.23 3.65,13.6 v3.65,14.2
  Bottom 0.5: v3.65,14.2 2.7,13.25 R22.2 R24.2
N$12
  pour Top (no thermals): 8.5,9.4 10.9,9.4 10.9,6 8.5,6
N$13  (via drill 0.5)
  Top 0.508: v13.7,0.69 13.6,0.79 D49.C
  Bottom 0.5: R36.2 R33.2 14.39,0.69 v13.7,0.69
N$14
  pour Top (no thermals): 12.4,5.5 14.8,5.5 14.8,5.1 13.95,5.1 13.8,4.95 13.8,4.05 14.05,3.8 14.8,3.8 14.8,2.1 12.4,2.1
N$15
  pour Top (no thermals): 12.4,9.4 14.8,9.4 14.8,6 12.4,6
N$16  (via drill 0.5)
  Top 0.5: v15.49,3.1 15.87,2.72 15.87,1.67 17.25,1.67 D40.C
  Bottom 0.5: R30.2 R27.2 13.4,3.5 15.09,3.5 v15.49,3.1
N$17
  pour Top (no thermals): 16.3,5.5 18.7,5.5 18.7,2.1 16.3,2.1
N$18
  pour Top (no thermals): 16.3,9.4 18.7,9.4 18.7,6 16.3,6 16.3,7.7 17.9,7.7 17.9,8.9 16.3,8.9
N$19
  pour Top (no thermals): 0.7,17.3 3.1,17.3 3.1,13.9 0.7,13.9
N$20
  pour Top (no thermals): 0.7,21.2 3.1,21.2 3.1,17.8 0.7,17.8
N$21
  pour Bottom (no thermals): 0.5,15.5 0.5,14.7 12.8,14.7 12.8,16.1 9.8,16.1 9.8,18.3 7.5,18.3 7.5,15.5
N$22
  Bottom 0.3: U8.5 18.15,7.85 17.5,7.2 16.1,7.2 15.53,6.63 R82.1
N$23
  Bottom 0.3: Q6.4 6.67,5.98 6.4,5.7 R49.2
N$24  (via drill 0.2, 0.3)
  Top 0.152: U5.5 17.4,26.5 17.57,26.33
  Top 0.2: 12.37,23.8 11.97,23.41 v11.95,23.41 | v10.18,25.8 U3.B1
  Top 0.3: 17.25,26.62 U5.5 | 17.57,26.33 R50.1 | 12.37,23.8 15.3,23.8 16.2,24.7 v16.2,24.8 | v17.6,27.3 17.6,26.7 17.4,26.5
  Route15 0.2: v10.18,25.8 11.95,24.03 v11.95,23.41
  Bottom 0.3: v17.6,27.3 17.55,27.25 17.55,25.43 17.17,25.05 16.45,25.05 v16.2,24.8
N$25
  Bottom 0.3: R19.2 5.49,32.93 Q1.4
N$26
  Bottom 0.3: U2.5 5,16.15 5.22,16.37 R20.1
N$27
  Bottom 0.3: R51.2 36.94,3.38 Q5.4
N$28
  Bottom 0.3: R83.1 54.78,4.15 U9.5
N$29  (via drill 0.5)
  Top 0.5: D24.C 4.92,13.23 v3.9,12.2
  Bottom 0.5: R18.2 R16.2 4.3,12.6 v3.9,12.2
N$30
  pour Top (no thermals): 4.6,17.3 7,17.3 7,13.9 4.6,13.9
N$31
  pour Top (no thermals): 4.6,21.2 7,21.2 7,17.8 4.6,17.8
N$32  (via drill 0.5)
  Top 0.5: D18.C 7.9,13.23 v7.9,14
  Bottom 0.5: v7.9,14 7.9,13.5 R12.2 R14.2
N$33
  pour Top (no thermals): 8.5,17.3 10.9,17.3 10.9,13.9 8.5,13.9
N$34
  pour Top (no thermals): 8.5,21.2 10.9,21.2 10.9,17.8 8.5,17.8
N$35  (via drill 0.5)
  Top 0.5: D12.C 12.2,13.23 11.7,13.73 v11.7,13.9
  Bottom 0.5: v11.7,13.9 11.7,13.5 R7.2 R9.2
N$36
  pour Top (no thermals): 12.4,17.3 14.8,17.3 14.8,13.9 12.4,13.9
N$37
  pour Top (no thermals): 12.4,21.2 14.8,21.2 14.8,17.8 12.4,17.8
N$38  (via drill 0.5)
  Top 0.5: v15.5,14.7 15.5,13.7 15.98,13.23 D6.C
  Bottom 0.5: R4.2 R2.2 12.6,18 14.2,16.4 14.2,16 v15.5,14.7
N$39
  pour Top (no thermals): 16.3,17.3 18.7,17.3 18.7,13.9 16.3,13.9
N$40
  pour Top (no thermals): 16.3,21.2 18.7,21.2 18.7,17.8 16.3,17.8
N$41
  Bottom 0.3: Q2.4 5.87,17.98 5.5,17.6 R20.2
N$42
  Bottom 0.3: U10.5 4.37,46.63 R84.1
N$43
  Top 0.2: 11.8,25.9 C15.1 | 11.8,25.9 R10.2 | 11.8,25.9 11.3,25.9 11.2,25.8 U3.B2
N$44
  Top 0.2: U3.D2 10.9,24.85 10.71,24.66 8.56,24.66 U4.1
N$45
  Top 0.2: U3.C2 10.96,25.34 11.04,25.34 11.8,24.58 C15.2
N$46  (via drill 0.2, 0.4, 0.5)
  Top 0.2: 8.7,26.02 8.7,25.81
  Top 0.4: U4.3 8.7,26.02 | 8.7,25.81 v8.45,25.56 6.45,25.56 v6.05,25.16 5.61,24.73 U4.8
  Route2 0.7: 0.6,24.1 0.73,24.23 7.68,24.23 8.55,25.1 8.55,25.46 v8.45,25.56
  Route2 1: 0.6,24.1 0.6,18.3 1.77,17.13 1.77,15.74 0.7,14.68 0.7,5.88 1.77,4.82 1.77,3.67 0.7,2.6 0.7,1.4 1.5,0.6 11.4,0.6 11.8,1 11.96,1 12.67,1.7 16.11,1.7 16.42,1.4 22,1.4 23.6,3 v27.1,3
  Route15 0.7: v11.85,21.2 11.85,22.26 9.34,24.77 7.03,24.77 6.64,25.16 v6.05,25.16
  Bottom 0.4: v8.45,25.56 8.49,25.6 9,25.6
  Bottom 0.5: C5.1 9.07,25.08 9.05,25.06 9,25.11 9,25.6 C10.1
  other vias: 27.1,2.5 27.7,2.5 27.7,3 27.1,3.5 27.7,3.5 27.1,2 27.7,2
  pour Bottom (no thermals): 25.2,4.7 25.2,1.7 29.8,1.7 29.8,4.7
  pour Route2 (no thermals): 26.9,3.9 26.9,1.9 28,1.9 28,3.9
  pour Bottom (rank 2, no thermals): 10.1,21.6 10.1,20.7 12.3,20.7 12.3,21.6
N$47  (via drill 0.5)
  Top 0.5: D27.C 3.65,28.23 v3.65,28.4
  Bottom 0.5: v3.65,28.4 3.3,28.4 2.7,27.8 R21.2 R23.2
N$48
  pour Top (no thermals): 0.7,32.3 3.1,32.3 3.1,28.9 0.7,28.9
N$49
  pour Top (no thermals): 0.7,36.2 3.1,36.2 3.1,32.8 0.7,32.8
N$50
  pour Bottom (no thermals): 12.3,29.1 12.3,29.8 10.9,29.8 10.9,32.7 6.9,32.7 6.9,29.9 0.5,29.9 0.5,29.1
N$51
  Bottom 0.7: Q3.PAD 11.6,24.3 TP1.TP
  pour Bottom (rank 2, no thermals): 8.7,21.9 14.2,21.9 14.2,24.1 15.9,24.1 15.9,27.6 16,27.6 16,27.9 8.7,27.9
N$52  (via drill 0.5)
  Top 0.5: D21.C 7.6,28.23 v7.6,28.4
  Bottom 0.5: v7.6,28.4 6.3,28.4 5.7,27.8 R17.2 R15.2
N$53
  pour Top (no thermals): 4.6,32.3 7,32.3 7,28.9 4.6,28.9
N$54
  pour Top (no thermals): 4.6,36.2 7,36.2 7,32.8 4.6,32.8
N$55  (via drill 0.5)
  Top 0.5: v11.5,28.5 11.23,28.23 D15.C
  Bottom 0.5: 8.6,27.6 R13.2 | R13.2 R11.2 | R13.2 8.6,27.85 9.25,28.5 v11.5,28.5
N$56
  pour Top (no thermals): 8.5,32.3 10.9,32.3 10.9,28.9 8.5,28.9
N$57
  pour Top (no thermals): 8.5,36.2 10.9,36.2 10.9,32.8 8.5,32.8
N$58  (via drill 0.5)
  Top 0.5: D9.C 15.3,28.23 v15.4,28.3
  Bottom 0.5: R8.2 R6.2 11.75,27.65 11.81,27.65 12.46,28.3 v15.4,28.3
N$59
  pour Top (no thermals): 12.4,32.3 14.8,32.3 14.8,28.9 12.4,28.9
N$60
  pour Top (no thermals): 12.4,36.2 14.8,36.2 14.8,32.8 12.4,32.8
N$61  (via drill 0.5)
  Top 0.5: D3.C 16.8,28.23 v16.8,27.5
  Bottom 0.5: v16.8,27.5 16.8,28.2 14.4,30.6 12.5,30.6 R1.2 R3.2
N$62
  pour Top (no thermals): 16.3,32.3 18.7,32.3 18.7,28.9 16.3,28.9
N$63
  pour Top (no thermals): 16.3,36.2 18.7,36.2 18.7,32.8 16.3,32.8
N$64
  Bottom 0.3: 4.48,31.75 U1.5 5,31.75 R19.1
N$66  (via drill 0.2)
  Top 0.2: v5.93,25.84 5.83,25.74 5.83,25.73 5.47,25.38 U4.7
  Route2 0.2: v5.93,25.84 6.19,26.1 8.95,26.1 9.3,25.75 9.3,24.87 v8.52,24.09
  Bottom 0.2: Q3.4 8.53,22.18 8.53,23.75 8.52,23.76 v8.52,24.09
N$70
  Top 0.5: R52.2 R55.2 23.7,27.5 22.98,28.23 D70.C
N$71
  pour Top (no thermals): 20.4,32.3 22.8,32.3 22.8,28.9 20.4,28.9
N$72
  pour Top (isolate 0.1, no thermals): 20.4,36.2 22.8,36.2 22.8,32.8 20.4,32.8
N$73
  pour Top (no thermals): 38,24.3 38,25.8 22.9,25.8 22.9,27.1 20.2,27.1 20.2,24.3
N$75
  Top 0.5: 25.88,28.23 D61.C 26.48,28.23 27.4,27.3 27.4,26.8 | R43.2 26.7,26.9 26.8,26.8 27.4,26.8 | R46.2 27.4,26.8
N$76
  pour Top (no thermals): 24.3,32.3 26.7,32.3 26.7,28.9 24.3,28.9
N$77
  pour Top (no thermals): 24.3,36.2 26.7,36.2 26.7,32.8 24.3,32.8
N$78
  Top 0.5: D52.C 29.4,27.1 R37.2 R40.2
N$79
  pour Top (no thermals): 28.2,32.3 30.6,32.3 30.6,28.9 28.2,28.9
N$80
  pour Top (no thermals): 28.2,36.2 30.6,36.2 30.6,32.8 28.2,32.8
N$81
  Top 0.5: 33.3,26.8 R31.2 | 33.3,26.8 D43.C | R34.2 33.3,26.8
N$82
  pour Top (no thermals): 32.1,32.3 34.5,32.3 34.5,28.9 32.1,28.9
N$83
  pour Top (no thermals): 32.1,36.2 34.5,36.2 34.5,32.8 32.1,32.8
N$84
  Top 0.5: D34.C R28.2 R25.2
N$85
  pour Top (no thermals): 36,32.3 38.4,32.3 38.4,28.9 36,28.9
N$86
  pour Top (no thermals): 36,36.2 38.4,36.2 38.4,32.8 36,32.8
N$87
  Top 0.3: R50.2 18.74,24.73 Q4.4
N$93  (via drill 0.5)
  Top 0.5: v19.6,14.3 19.97,13.93 19.97,13.47 20.22,13.23 D115.C
  Bottom 0.5: R88.2 R85.2 13.07,11.97 13.13,11.97 13.13,12.28 13.35,12.5 14.5,12.5 16.3,14.3 v19.6,14.3
N$94
  pour Top (no thermals): 20.4,17.3 22.8,17.3 22.8,13.9 20.4,13.9
N$95
  pour Top (no thermals): 20.4,21.2 22.8,21.2 22.8,17.8 20.4,17.8
N$96
  pour Bottom (no thermals): 10.7,10.8 10.7,9.4 11.3,9.4 11.3,6.6 13.8,6.6 13.8,9.4 19,9.4 19,6.5 19.6,6.5 19.6,6.7 19.65,9.4 22.3,9.4 22.3,10.1 21.6,10.8
N$98  (via drill 0.5)
  Top 0.5: D106.C 23.83,13.23 23.2,12.6 20.18,12.6 19.99,12.4 v15.75,12.4
  Bottom 0.5: 15.6,11.7 R76.2 | 15.6,11.7 R79.2 15.75,11.75 v15.75,12.4 15.75,11.85 15.6,11.7
N$99
  pour Top (no thermals): 24.3,17.3 26.7,17.3 26.7,13.9 24.3,13.9
N$100
  pour Top (no thermals): 24.3,21.2 26.7,21.2 26.7,17.8 24.3,17.8
N$101  (via drill 0.5)
  Top 0.5: v27.3,14.1 27.3,13.23 D97.C
  Bottom 0.5: R70.2 R73.2 18.8,11.9 19.52,12.62 21.43,12.62 23.1,14.3 27.1,14.3 v27.3,14.1
N$102
  pour Top (no thermals): 28.2,17.3 30.6,17.3 30.6,13.9 28.2,13.9
N$103
  pour Top (no thermals): 28.2,21.2 30.6,21.2 30.6,17.8 28.2,17.8
N$104  (via drill 0.5)
  Top 0.5: 33.27,13.2 D88.C 31.3,13.23 v31.3,13.87
  Bottom 0.5: R64.2 R67.2 22.1,11.7 23.7,13.3 30.73,13.3 v31.3,13.87
N$105
  pour Top (no thermals): 32.1,17.3 34.5,17.3 34.5,13.9 32.1,13.9
N$106
  pour Top (no thermals): 32.1,21.2 34.5,21.2 34.5,17.8 32.1,17.8
N$107  (via drill 0.5)
  Top 0.5: D79.C 36.29,12.32 v31.88,12.32
  Route15 0.5: v20.75,8.25 20.75,9.02 v24.05,12.32
  Bottom 0.5: R58.2 R61.2 21.05,8.25 v20.75,8.25 | v31.88,12.32 31.82,12.38 24.11,12.38 v24.05,12.32
N$108
  pour Top (no thermals): 36,17.3 38.4,17.3 38.4,13.9 36,13.9
N$109
  pour Top (no thermals): 36,21.2 38.4,21.2 38.4,17.8 36,17.8
N$110
  Bottom 0.3: Q7.4 14.47,6.54 R82.2
N$116  (via drill 0.35)
  Top 0.4: v23.3,6.8 23.23,6.73 23.23,6.12 | 23.23,6.12 | 23.23,6.12 23.23,5.8
  Top 0.5: D73.C 22.98,1.42 23.23,1.67 23.23,5.8 23.23,6.05
  Bottom 0.5: R53.2 R56.2 22.7,6.2 v23.3,6.8
N$117
  pour Top (no thermals): 20.4,5.5 22.8,5.5 22.8,2.1 20.4,2.1
N$118
  pour Top (no thermals): 20.4,9.4 22.8,9.4 22.8,6 20.4,6
N$119
  pour Bottom (no thermals): 22.1,7.9 22.1,7.1 32.2,7.1 32.9,6.4 38.5,6.4 39,5.9 39,4.2 38.6,4.2 38.6,1.2 41.1,1.2 41.1,3.5 40,3.5 40,6.3 39.1,7.2 33.4,7.2 32.7,7.9
N$121  (via drill 0.35)
  Top 0.4: v23.83,6.37 23.87,6.32 23.87,5.83
  Top 0.5: D64.C 24.12,1.42 23.87,1.67 23.87,5.83
  Bottom 0.5: R47.2 R44.2 27.3,6.12 27.05,6.37 v23.83,6.37
N$122
  pour Top (no thermals): 24.3,5.5 26.7,5.5 26.7,2.1 24.3,2.1
N$123
  pour Top (no thermals): 24.3,9.4 26.7,9.4 26.7,6 24.3,6
N$124  (via drill 0.5)
  Top 0.5: D55.C 30.93,1.42 30.93,1.57 31.03,1.67 31.03,6.33 v31.3,6.6
  Bottom 0.5: 31.3,5.6 v31.3,6.6 | 31.3,5.6 R41.2 | R38.2 31.3,5.6
N$125
  pour Top (no thermals): 28.2,5.5 30.6,5.5 30.6,2.1 28.2,2.1
N$126
  pour Top (no thermals): 28.2,9.4 30.6,9.4 30.6,6 28.2,6
N$127  (via drill 0.5)
  Top 0.5: D46.C 34.68,1.42 34.93,1.67 34.93,5.63 v35.2,5.9
  Bottom 0.5: v35.2,5.9 R35.2 R32.2
N$128
  pour Top (no thermals): 32.1,5.5 34.5,5.5 34.5,2.1 32.1,2.1
N$129
  pour Top (no thermals): 32.1,9.4 34.5,9.4 34.5,6 32.1,6
N$130  (via drill 0.5)
  Top 0.5: D37.C 38.73,1.42 39.3,2 39.3,3.8 v38.6,4.5
  Bottom 0.5: v38.6,4.5 R29.2 R26.2
N$131
  pour Top (no thermals): 36,5.5 38.4,5.5 38.4,2.1 36,2.1
N$132
  pour Top (no thermals): 36,9.4 38.4,9.4 38.4,6 36,6
N$133
  Bottom 0.3: R51.1 36.38,1.75 U6.5
N$139  (via drill 0.5)
  Top 0.5: v41.08,0.66 41.34,0.92 D118.C
  Bottom 0.5: R86.2 R89.2 41.45,0.9 41.43,0.87 41.29,0.87 v41.08,0.66
N$140
  pour Top (no thermals): 41.4,5 43.8,5 43.8,1.6 41.4,1.6
N$141
  pour Top (no thermals): 41.4,8.9 43.8,8.9 43.8,5.5 41.4,5.5
N$142
  pour Bottom (no thermals): 41.7,3.4 41.7,2.5 59.7,2.5 59.7,7 57.2,7 57.2,3.4
N$144  (via drill 0.5)
  Top 0.5: D109.C 45.12,0.92 44.87,1.17 44.87,1.45 v44.53,1.8
  Bottom 0.5: R77.2 R80.2 45.43,0.9 v44.53,1.8
N$145
  pour Top (no thermals): 45.3,5 47.7,5 47.7,1.6 45.3,1.6
N$146
  pour Top (no thermals): 45.3,8.9 47.7,8.9 47.7,5.5 45.3,5.5
N$147  (via drill 0.5)
  Top 0.5: D100.C 48.98,0.92 v48.6,1.3
  Bottom 0.5: v48.6,1.3 49,0.9 R71.2 R74.2
N$148
  pour Top (no thermals): 49.2,5 51.6,5 51.6,1.6 49.2,1.6
N$149
  pour Top (no thermals): 49.2,8.9 51.6,8.9 51.6,5.5 49.2,5.5
N$150  (via drill 0.5)
  Top 0.5: D91.C 52.98,0.92 v52.4,1.5
  Bottom 0.5: v52.4,1.5 53,0.9 R65.2 R68.2
N$151
  pour Top (no thermals): 53.1,5 55.5,5 55.5,1.6 53.1,1.6
N$152
  pour Top (no thermals): 53.1,8.9 55.5,8.9 55.5,5.5 53.1,5.5
N$153  (via drill 0.5)
  Top 0.5: v56.3,1.4 56.77,0.92 D82.C
  Bottom 0.5: R62.2 R59.2 56.9,0.8 v56.3,1.4
N$154
  pour Top (no thermals): 57,5 59.4,5 59.4,1.6 57,1.6
N$155
  pour Top (no thermals): 57,8.9 59.4,8.9 59.4,5.5 57,5.5
N$156
  Bottom 0.3: Q8.4 55.77,6.58 55.3,6.1 R83.2
N$162  (via drill 0.5)
  Top 0.5: D121.C 0.83,56.58 v0.9,56.5
  Bottom 0.5: v0.9,56.5 R90.2 R87.2
N$163
  pour Top (no thermals): 1.7,57.2 1.7,59.6 5.1,59.6 5.1,57.2
N$164
  pour Top (no thermals): 5.6,57.2 5.6,59.6 9,59.6 9,57.2
N$165
  pour Bottom (no thermals): 2.7,56.4 3.6,56.4 3.6,53.9 3,53.3 3,44 6.2,43.9 6.2,41.74 5.76,41.31 2.2,41.4 2.2,53.5 2.7,54
N$167  (via drill 0.5)
  Top 0.5: D112.C 0.83,53.33 v0.6,53.1
  Bottom 0.4: R81.2 v0.6,53.1
  Bottom 0.5: R78.2 R81.2
N$168
  pour Top (no thermals): 1.7,53.3 1.7,55.7 5.1,55.7 5.1,53.3
N$169
  pour Top (no thermals): 5.6,53.3 5.6,55.7 9,55.7 9,53.3
N$170  (via drill 0.5)
  Top 0.5: D103.C 0.83,48.92 v0.8,48.9
  Bottom 0.4: R75.2 v0.8,48.9
  Bottom 0.5: v0.8,48.9 R72.2
N$171
  pour Top (no thermals): 1.7,49.4 1.7,51.8 5.1,51.8 5.1,49.4
N$172
  pour Top (no thermals): 5.6,49.4 5.6,51.8 9,51.8 9,49.4
N$173  (via drill 0.5)
  Top 0.5: D94.C 0.83,45.23 v0.6,45
  Bottom 0.5: R66.2 R69.2 v0.6,45
N$174
  pour Top (no thermals): 1.7,45.5 1.7,47.9 5.1,47.9 5.1,45.5
N$175
  pour Top (no thermals): 5.6,45.5 5.6,47.9 9,47.9 9,45.5
N$176  (via drill 0.5)
  Top 0.5: D85.C 0.83,41.02 v0.7,40.9
  Bottom 0.5: R60.2 R63.2 0.8,41 v0.7,40.9
N$177
  pour Top (no thermals): 1.7,41.6 1.7,44 5.1,44 5.1,41.6
N$178
  pour Top (no thermals): 5.6,41.6 5.6,44 9,44 9,41.6
N$179
  Bottom 0.3: R84.2 5.77,45.76 Q9.4
RED_C  (via drill 0.2)
  Top 0.2: D31.1 1.47,26.46 1.91,26.02 3,26.02 v3.15,26.17
  Route15 0.2: 19.93,6.7 v20,6.63 | v20,6.63 19.97,6.63 | v20,6.63 19.97,6.6 12.91,6.6 10,3.69 6.44,3.69 5.23,4.9 5.23,6.57 4.63,7.17 2.93,7.17 2.6,7.5 2.6,14.3 3.2,14.9 4.9,14.9 6.2,16.2 6.2,20.2 4.75,21.65 4.15,21.65 2.72,23.08 2.72,25.74 v3.15,26.17
  Bottom 0.2: J1.22 19.75,5.2 19.91,5.36 19.91,6.53 v20,6.62 v20,6.63
SYNC  (via drill 0.2)
  Top 0.2: U5.3 14.7,24.9 v15.4,24.9
  Route15 0.2: 1.75,18.1 1.75,27.3 | 1.75,27.3 1.75,29.65 2.6,30.5 2.6,34.83 | v3.48,18.1 1.75,18.1 | 2.6,34.83 2.6,48.8 3.29,49.49 5.09,49.49 v5.53,49.05 | 32.7,4.22 v32.72,4.2 34.39,2.53 40.3,2.53 42.67,4.9 49,4.9 51.3,7.2 v51.3,7.6 | 20.77,4.08 v20.77,4.13 20.77,2.37 20.18,1.77 18.3,1.77 17.1,2.97 17.1,4.26 16.07,5.28 v15.23,5.28 13.53,5.28 10.95,2.7 2.55,2.7 1.75,3.5 1.75,6.3 | 1.75,18.1 1.75,6.3 | 3.48,6.33 v3.48,6.4 3.33,6.4 3.31,6.37 1.82,6.37 1.75,6.3 | 2.6,34.83 v1.74,34.83 | v15.4,24.9 14.12,26.18 12,26.18 10.88,27.3 1.75,27.3
  Bottom 0.127: J1.20 20.75,4.83 20.91,4.99 21.29,4.99 21.3,5 31.92,5 v32.72,4.2 32.85,4.07 U6.3 | U9.3 51.45,6.25
  Bottom 0.2: 3.03,5.95 U7.3 | J1.20 20.75,4.15 v20.77,4.13 | v3.48,6.4 3.1,6.4 U7.3 | U8.3 16.25,5.7 15.83,5.28 v15.23,5.28 | v51.3,7.6 51.3,6.4 51.45,6.25 51.61,6.09 | U7.3 1.78,5.95 R5.2 | U2.3 arc-90 2,18.1 v3.48,18.1 | v1.74,34.83 1.15,34.24 U1.3 | U10.3 5.53,49.83 v5.53,49.05

## Text on the board
bPlace: Lighthouse Sync. Booster | Rev. 1.2 / CERN OHL v1.2 / JPN, MWL@MIT / 2019